# Altium schematic sheet MCU.SchDoc: MCU_STM32F407VGT6
size A3
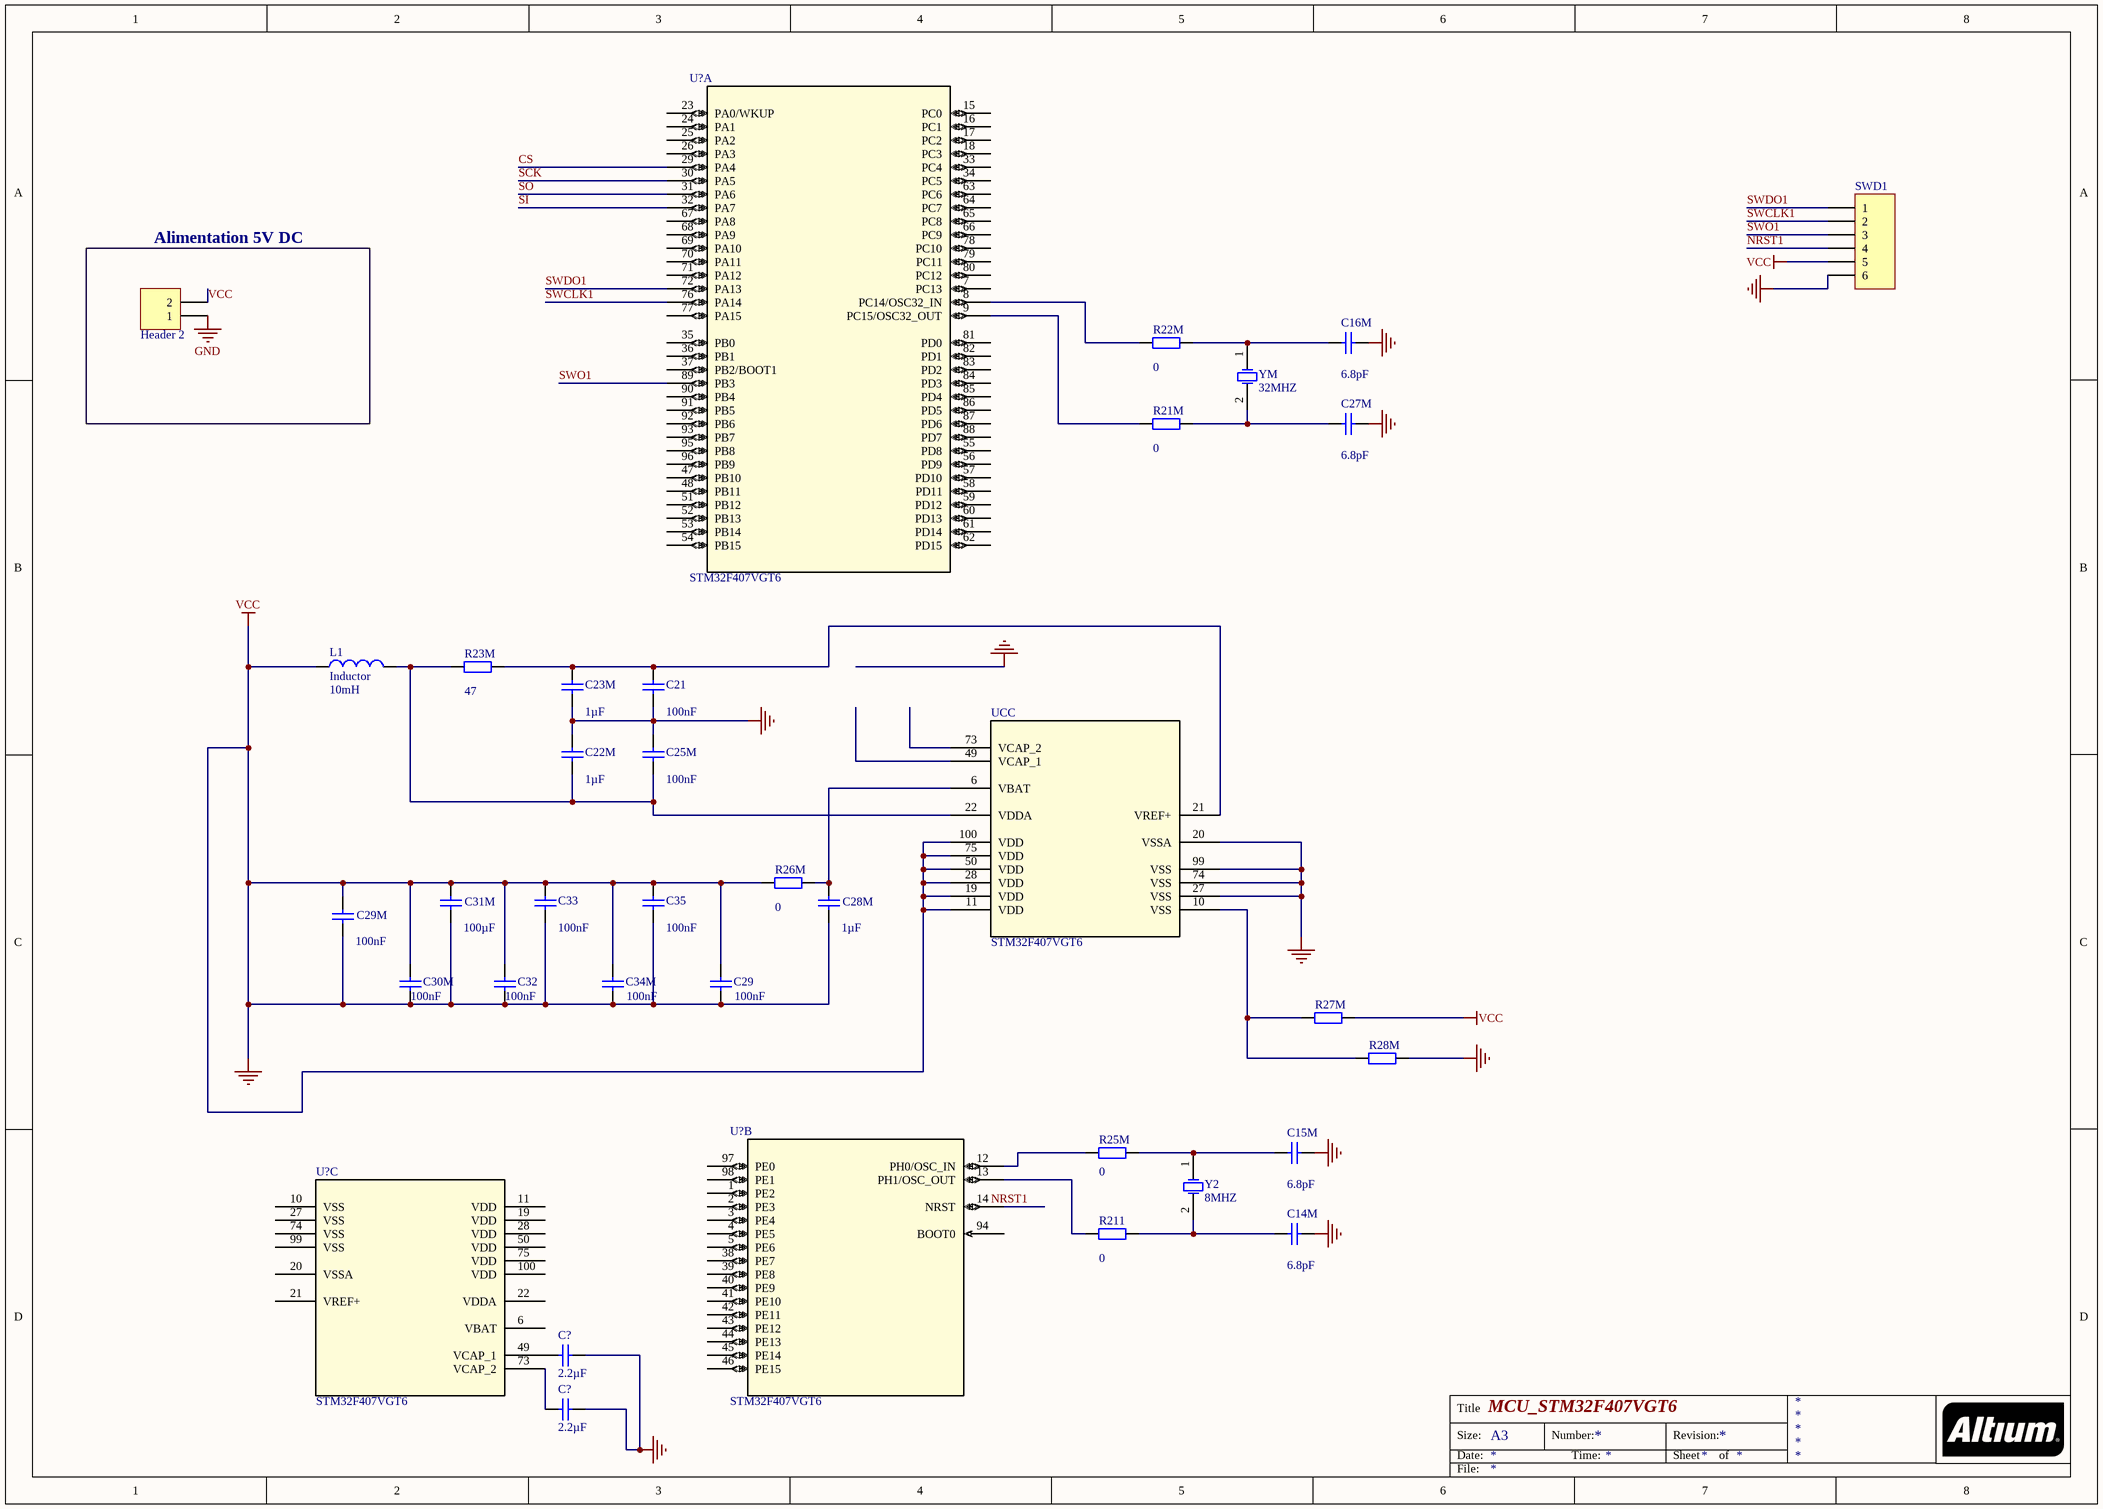
[diagram p0: MCU.SchDoc]

## Parts
(Parts that share a designator on the sheet are numbered #1, #2 ... from top to bottom, then left to right.)
Alimentation_5V_DC  Header 2  [HDR1X2]
C14M  value 6.8pF  [RAD-0.3]  (hidden comment: Cap)
C15M  value 6.8pF  [RAD-0.3]  (hidden comment: Cap)
C16M  value 6.8pF  [RAD-0.3]  (hidden comment: Cap)
C21  value 100nF  [RAD-0.3]  (hidden comment: Cap)
C22M  value 1µF  [RAD-0.3]  (hidden comment: Cap)
C23M  value 1µF  [RAD-0.3]  (hidden comment: Cap)
C25M  value 100nF  [RAD-0.3]  (hidden comment: Cap)
C27M  value 6.8pF  [RAD-0.3]  (hidden comment: Cap)
C28M  value 1µF  [RAD-0.3]  (hidden comment: Cap)
C29  value 100nF  [RAD-0.3]  (hidden comment: Cap)
C29M  value 100nF  [RAD-0.3]  (hidden comment: Cap)
C30M  value 100nF  [RAD-0.3]  (hidden comment: Cap)
C31M  value 100µF  [RAD-0.3]  (hidden comment: Cap)
C32  value 100nF  [RAD-0.3]  (hidden comment: Cap)
C33  value 100nF  [RAD-0.3]  (hidden comment: Cap)
C34M  value 100nF  [RAD-0.3]  (hidden comment: Cap)
C35  value 100nF  [RAD-0.3]  (hidden comment: Cap)
C?#1  value 2.2µF  [RAD-0.3]  (hidden comment: Cap)
C?#2  value 2.2µF  [RAD-0.3]  (hidden comment: Cap)
L1  Inductor  value 10mH  [0402-A]
R21M  value 0  [AXIAL-0.4]  (hidden comment: Res2)
R22M  value 0  [AXIAL-0.4]  (hidden comment: Res2)
R23M  value 47  [AXIAL-0.4]  (hidden comment: Res2)
R25M  value 0  [AXIAL-0.4]  (hidden comment: Res2)
R26M  value 0  [AXIAL-0.4]  (hidden comment: Res2)
R27M  Res2  [AXIAL-0.4]  (value not drawn)
R28M  Res2  [AXIAL-0.4]  (value not drawn)
R211  value 0  [AXIAL-0.4]  (hidden comment: Res2)
SWD1  Header 6H  [HDR1X6H]  (value not drawn)
U?#1  STM32F407VGT6  [LQFP100-14x14mm]  (part A of 3)
U?#2  STM32F407VGT6  [LQFP100-14x14mm]  (part B of 3)
U?#3  STM32F407VGT6  [LQFP100-14x14mm]  (part C of 3)
UC  STM32F407VGT6  [LQFP100-14x14mm]  (part C of 3)
Y2  8MHZ  [R38]
YM  32MHZ  [R38]

## Nets
GND: Alimentation_5V_DC.1
VCC: Alimentation_5V_DC.2 C14M.1 C15M.1 C16M.1 C21.1 C22M.2 C23M.1 C25M.2 C27M.1 C28M.1 C29.1 C29.2 C29M.1 C29M.2 C30M.1 C30M.2 C31M.1 C31M.2 C32.1 C32.2 C33.1 C33.2 C34M.1 C34M.2 C35.1 C35.2 C?#1.1 C?#2.1 L1.1 R26M.1 R27M.2 R28M.1 SWD1.5 SWD1.6 UC.11(VDD) UC.19(VDD) UC.20(VSSA) UC.27(VSS) UC.28(VDD) UC.50(VDD) UC.74(VSS) UC.75(VDD) UC.99(VSS) UC.100(VDD)
CS: U?#1.29(PA4)
NRST1: SWD1.4
SCK: U?#1.30(PA5)
SI: U?#1.32(PA7)
SO: U?#1.31(PA6)
SWCLK1: SWD1.2 U?#1.76(PA14)
SWDO1: SWD1.1 U?#1.72(PA13)
SWO1: SWD1.3 U?#1.89(PB3)
NetC14M_2: C14M.2 R211.2 Y2.2(OSC2)
NetC15M_2: C15M.2 R25M.2 Y2.1(OSC1)
NetC16M_2: C16M.2 R22M.2 YM.1(OSC1)
NetC21_2: C21.2 C23M.2 R23M.2 UC.21(VREF+)
NetC22M_1: C22M.1 C25M.1 L1.2 R23M.1 UC.22(VDDA)
NetC27M_2: C27M.2 R21M.2 YM.2(OSC2)
NetC28M_2: C28M.2 R26M.2 UC.6(VBAT)
NetC?#1_2: C?#1.2 U?#3.49(VCAP_1)
NetC?#2_2: C?#2.2 U?#3.73(VCAP_2)
NetR21M_1: R21M.1 U?#1.9(PC15/OSC32_OUT)
NetR22M_1: R22M.1 U?#1.8(PC14/OSC32_IN)
NetR25M_1: R25M.1 U?#2.12(PH0/OSC_IN)
NetR27M_1: R27M.1 R28M.2 UC.10(VSS)
NetR211_1: R211.1 U?#2.13(PH1/OSC_OUT)

Not connected (* = marked no-connect by the designer): U?#1 7(PC13) 15(PC0) 16(PC1) 17(PC2) 18(PC3) 23(PA0/WKUP) 24(PA1) 25(PA2) 26(PA3) 33(PC4) 34(PC5) 35(PB0) 36(PB1) 37(PB2/BOOT1) 47(PB10) 48(PB11) 51(PB12) 52(PB13) 53(PB14) 54(PB15) 55(PD8) 56(PD9) 57(PD10) 58(PD11) 59(PD12) 60(PD13) 61(PD14) 62(PD15) 63(PC6) 64(PC7) 65(PC8) 66(PC9) 67(PA8) 68(PA9) 69(PA10) 70(PA11) 71(PA12) 77(PA15) 78(PC10) 79(PC11) 80(PC12) 81(PD0) 82(PD1) 83(PD2) 84(PD3) 85(PD4) 86(PD5) 87(PD6) 88(PD7) 90(PB4) 91(PB5) 92(PB6) 93(PB7) 95(PB8) 96(PB9); U?#2 1(PE2) 2(PE3) 3(PE4) 4(PE5) 5(PE6) 14(NRST) 38(PE7) 39(PE8) 40(PE9) 41(PE10) 42(PE11) 43(PE12) 44(PE13) 45(PE14) 46(PE15) 94(BOOT0) 97(PE0) 98(PE1); U?#3 6(VBAT) 10(VSS) 11(VDD) 19(VDD) 20(VSSA) 21(VREF+) 22(VDDA) 27(VSS) 28(VDD) 50(VDD) 74(VSS) 75(VDD) 99(VSS) 100(VDD); UC 49(VCAP_1) 73(VCAP_2)

## Notes on the sheet
- Labels drawn without touching a wire or pin: NRST1
- Title
- Size:
- Date:
- A3
- Number:
- Time:
- Revision:
- Sheet
- of
- File:

## Library data of the parts
Alimentation_5V_DC = Header 2: Header, 2-Pin; LatestRevisionDate: 17-Jul-2002; LatestRevisionNote: Re-released for DXP Platform.; Publisher: Altium Limited
C14M C15M C16M C21 C22M C23M C25M C27M C28M C29 C29M C30M C31M C32 C33 C34M C35 C?#1 C?#2 = Cap: Capacitor; Published: 8-Jun-2000; LatestRevisionDate: 17-Jul-2002; LatestRevisionNote: Re-released for DXP Platform.; PackageReference: RAD-0.3; Publisher: Altium Limited; PackageDescription: Radial Cap, Thru-Hole; 2 Leads; 0.3 in Pin Spacing
L1 = Inductor: Code_IEC: 1005; Published: 8-Jun-2000; LatestRevisionDate: 29-May-2009; LatestRevisionNote: IPC-7351 Footprint Added.; PackageReference: 0402-A; Publisher: Altium Limited; PackageDescription: Chip Inductor; Code_JEITA: 0402
R21M R22M R23M R25M R26M R27M R28M R211 = Res2: Resistor; Published: 8-Jun-2000; LatestRevisionDate: 17-Jul-2002; LatestRevisionNote: Re-released for DXP Platform.; PackageReference: AXIAL-0.4; Publisher: Altium Limited; PackageDescription: Axial Device, Thru-Hole; 2 Leads; 0.4 in Pin Spacing
SWD1 = Header 6H: Header, 6-Pin, Right Angle; LatestRevisionDate: 17-Jul-2002; LatestRevisionNote: Re-released for DXP Platform.; Publisher: Altium Limited
U?#1-U?#3 UC = STM32F407VGT6: No Description Available; Mfr_Name: STMicroelectronics; RefDes: RefDes; Type: Type
Y2 YM = XTAL: Crystal Oscillator; Published: 8-Jun-2000; LatestRevisionDate: 17-Jul-2002; LatestRevisionNote: Re-released for DXP Platform.; PackageReference: R38; Publisher: Altium Limited; PackageDescription: Crystal, Thru-Hole; 2 Leads; Body 3.1 x 8.2 mm (Dia.xH)